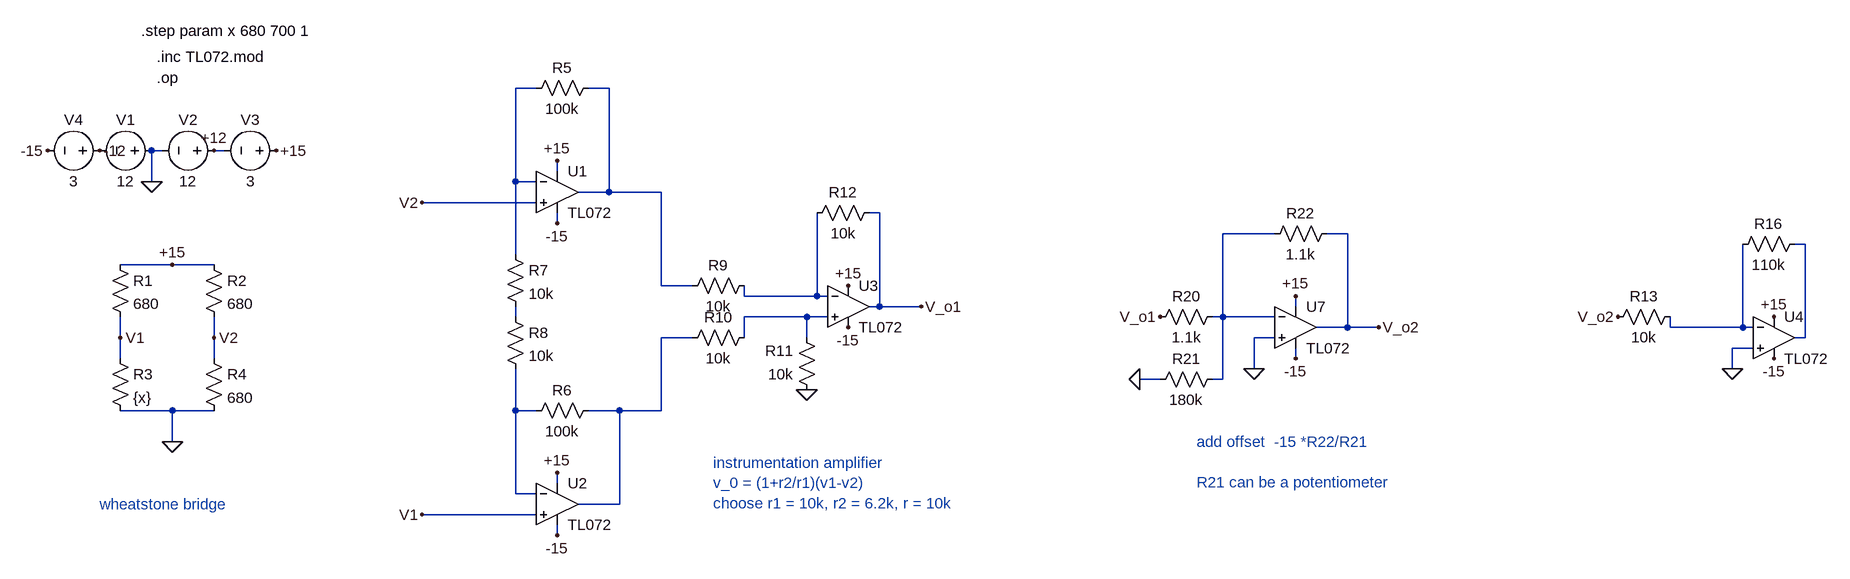
[diagram p0: schematic Draft1.asc]
Draft1.asc, the LTspice schematic file:
Version 4
SHEET 1 3256 748
WIRE 1008 -240 976 -240
WIRE 1120 -240 1088 -240
WIRE 432 -144 416 -144
WIRE 528 -144 512 -144
WIRE 1040 -112 1040 -128
WIRE 416 -96 416 -144
WIRE 976 -96 976 -240
WIRE 1008 -96 976 -96
WIRE 1120 -80 1120 -240
WIRE 1120 -80 1072 -80
WIRE 1200 -80 1120 -80
WIRE 1008 -64 832 -64
WIRE 1536 -48 1520 -48
WIRE 1040 -32 1040 -48
WIRE 2144 -16 2064 -16
WIRE 2256 -16 2224 -16
WIRE 2960 0 2944 0
WIRE 976 16 976 -96
WIRE 448 32 368 32
WIRE 512 32 448 32
WIRE 1200 64 1200 -80
WIRE 1248 64 1200 64
WIRE 1328 80 1328 64
WIRE 1440 80 1440 -48
WIRE 1440 80 1328 80
WIRE 1456 80 1440 80
WIRE 1536 96 1536 -48
WIRE 1536 96 1520 96
WIRE 1600 96 1536 96
WIRE 2176 96 2176 80
WIRE 976 112 976 96
WIRE 1424 112 1328 112
WIRE 1456 112 1424 112
WIRE 2064 112 2064 -16
WIRE 2064 112 2048 112
WIRE 2144 112 2064 112
WIRE 2256 128 2256 -16
WIRE 2256 128 2208 128
WIRE 2304 128 2256 128
WIRE 2752 128 2752 112
WIRE 2864 128 2864 0
WIRE 2864 128 2752 128
WIRE 2880 128 2864 128
WIRE 368 144 368 112
WIRE 512 144 512 112
WIRE 1248 144 1200 144
WIRE 1328 144 1328 112
WIRE 1424 144 1424 112
WIRE 2144 144 2112 144
WIRE 2960 144 2960 0
WIRE 2960 144 2944 144
WIRE 2880 160 2848 160
WIRE 368 176 368 144
WIRE 512 176 512 144
WIRE 2176 176 2176 160
WIRE 2112 192 2112 144
WIRE 2848 192 2848 160
WIRE 1968 208 1936 208
WIRE 2064 208 2064 112
WIRE 2064 208 2048 208
WIRE 448 256 368 256
WIRE 512 256 448 256
WIRE 976 256 976 192
WIRE 1008 256 976 256
WIRE 1136 256 1088 256
WIRE 1200 256 1200 144
WIRE 1200 256 1136 256
WIRE 448 304 448 256
WIRE 1040 368 1040 352
WIRE 976 384 976 256
WIRE 1008 384 976 384
WIRE 1136 400 1136 256
WIRE 1136 400 1072 400
WIRE 1008 416 832 416
WIRE 1040 448 1040 432
FLAG 416 -96 0
FLAG 336 -144 -12
FLAG 512 -144 +12
FLAG 608 -144 +15
FLAG 448 32 +15
FLAG 1424 224 0
FLAG 256 -144 -15
FLAG 1488 64 +15
FLAG 1488 128 -15
FLAG 512 144 V2
FLAG 368 144 V1
FLAG 832 -64 V2
FLAG 832 416 V1
FLAG 1040 -128 +15
FLAG 1040 -32 -15
FLAG 1040 352 +15
FLAG 1040 448 -15
FLAG 2176 80 +15
FLAG 2112 192 0
FLAG 2176 176 -15
FLAG 448 304 0
FLAG 2304 128 V_o2
FLAG 2912 112 +15
FLAG 2912 176 -15
FLAG 2848 192 0
FLAG 1600 96 V_o1
FLAG 1968 112 V_o1
FLAG 2672 112 V_o2
FLAG 1936 208 0
SYMBOL voltage 432 -144 R90
WINDOW 0 -32 56 VBottom 2
WINDOW 3 32 56 VTop 2
SYMATTR InstName V1
SYMATTR Value 12
SYMBOL voltage 528 -144 R90
WINDOW 0 -32 56 VBottom 2
WINDOW 3 32 56 VTop 2
SYMATTR InstName V2
SYMATTR Value 12
SYMBOL voltage 624 -144 R90
WINDOW 0 -32 56 VBottom 2
WINDOW 3 32 56 VTop 2
SYMATTR InstName V3
SYMATTR Value 3
SYMBOL res 352 16 R0
SYMATTR InstName R1
SYMATTR Value 680
SYMBOL res 496 16 R0
SYMATTR InstName R2
SYMATTR Value 680
SYMBOL res 352 160 R0
SYMATTR InstName R3
SYMATTR Value {x}
SYMBOL res 496 160 R0
SYMATTR InstName R4
SYMATTR Value 680
SYMBOL res 1344 48 R90
WINDOW 0 0 56 VBottom 2
WINDOW 3 32 56 VTop 2
SYMATTR InstName R9
SYMATTR Value 10k
SYMBOL res 1344 128 R90
WINDOW 0 0 56 VBottom 2
WINDOW 3 32 56 VTop 2
SYMATTR InstName R10
SYMATTR Value 10k
SYMBOL res 1440 240 R180
WINDOW 0 36 76 Left 2
WINDOW 3 36 40 Left 2
SYMATTR InstName R11
SYMATTR Value 10k
SYMBOL res 1424 -32 R270
WINDOW 0 32 56 VTop 2
WINDOW 3 0 56 VBottom 2
SYMATTR InstName R12
SYMATTR Value 10k
SYMBOL Opamps\\opamp2 1488 32 R0
SYMATTR InstName U3
SYMATTR Value TL072
SYMBOL voltage 352 -144 R90
WINDOW 0 -32 56 VBottom 2
WINDOW 3 32 56 VTop 2
SYMATTR InstName V4
SYMATTR Value 3
SYMBOL OpAmps\\opamp2 1040 -144 R0
SYMATTR InstName U1
SYMATTR Value TL072
SYMBOL OpAmps\\opamp2 1040 336 R0
SYMATTR InstName U2
SYMATTR Value TL072
SYMBOL res 1104 -256 R90
WINDOW 0 0 56 VBottom 2
WINDOW 3 32 56 VTop 2
SYMATTR InstName R5
SYMATTR Value 100k
SYMBOL res 1104 240 R90
WINDOW 0 0 56 VBottom 2
WINDOW 3 32 56 VTop 2
SYMATTR InstName R6
SYMATTR Value 100k
SYMBOL res 960 0 R0
SYMATTR InstName R7
SYMATTR Value 10k
SYMBOL res 960 96 R0
SYMATTR InstName R8
SYMATTR Value 10k
SYMBOL OpAmps\\opamp2 2176 64 R0
SYMATTR InstName U7
SYMATTR Value TL072
SYMBOL res 2064 96 R90
WINDOW 0 0 56 VBottom 2
WINDOW 3 32 56 VTop 2
SYMATTR InstName R20
SYMATTR Value 1.1k
SYMBOL res 2064 192 R90
WINDOW 0 0 56 VBottom 2
WINDOW 3 32 56 VTop 2
SYMATTR InstName R21
SYMATTR Value 180k
SYMBOL res 2240 -32 R90
WINDOW 0 0 56 VBottom 2
WINDOW 3 32 56 VTop 2
SYMATTR InstName R22
SYMATTR Value 1.1k
SYMBOL res 2768 96 R90
WINDOW 0 0 56 VBottom 2
WINDOW 3 32 56 VTop 2
SYMATTR InstName R13
SYMATTR Value 10k
SYMBOL res 2848 16 R270
WINDOW 0 32 56 VTop 2
WINDOW 3 0 56 VBottom 2
SYMATTR InstName R16
SYMATTR Value 110k
SYMBOL Opamps\\opamp2 2912 80 R0
SYMATTR InstName U4
SYMATTR Value TL072
TEXT 424 -256 Left 2 !.op
TEXT 424 -288 Left 2 !.inc TL072.mod
TEXT 2024 304 Left 2 ;add offset  -15 *R22/R21\n \nR21 can be a potentiometer
TEXT 1280 336 Left 2 ;instrumentation amplifier\nv_0 = (1+r2/r1)(v1-v2)\nchoose r1 = 10k, r2 = 6.2k, r = 10k
TEXT 336 400 Left 2 ;wheatstone bridge
TEXT 400 -328 Left 2 !.step param x 680 700 1

The netlist it stands for:
* Draft1.asc
V1 0 -12 12
V2 +12 0 12
V3 +15 +12 3
R1 +15 V1 680
R2 +15 V2 680
R3 V1 0 {x}
R4 V2 0 680
R9 N005 N002 10k
R10 N007 N009 10k
R11 0 N007 10k
R12 N005 V_o1 10k
XU3 N007 N005 +15 -15 V_o1 TL072  ; pins In+ In- V+ V- OUT
V4 -12 -15 3
XU1 V2 N001 +15 -15 N002 TL072  ; pins In+ In- V+ V- OUT
XU2 V1 N010 +15 -15 N009 TL072  ; pins In+ In- V+ V- OUT
R5 N002 N001 100k
R6 N009 N010 100k
R7 N001 N006 10k
R8 N006 N010 10k
XU7 0 N003 +15 -15 V_o2 TL072  ; pins In+ In- V+ V- OUT
R20 N003 V_o1 1.1k
R21 N003 0 180k
R22 V_o2 N003 1.1k
R13 N008 V_o2 10k
R16 N008 N004 110k
XU4 0 N008 +15 -15 N004 TL072  ; pins In+ In- V+ V- OUT
.op
.inc TL072.mod
* add offset  -15 *R22/R21
* R21 can be a potentiometer
* instrumentation amplifier
* v_0 = (1+r2/r1)(v1-v2)
* choose r1 = 10k, r2 = 6.2k, r = 10k
* wheatstone bridge
.step param x 680 700 1
.backanno
.end

* Results of the author's LTspice run, read from the files saved beside the schematic
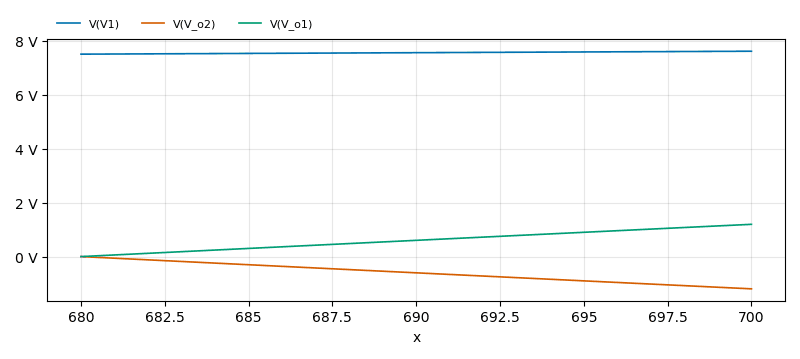
[diagram p1: Operating Point of Draft1.asc, plotted from the saved traces]
* Operating Point, 1 run:
*   V(V1): 7.5 V at x=680 , 7.609 V at x=700 , min 7.5 V, max 7.609 V
*   V(V_o2): 207 µV at x=680 , -1.195 V at x=700 , min -1.195 V, max 207 µV
*   V(V_o1): -184.9 µV at x=680 , 1.195 V at x=700 , min -184.9 µV, max 1.195 V
* From the log:
*   Semiconductor Device Operating Points:
*                           --- Diodes ---
*   Name:    d:u4:p      d:u4:ln     d:u4:lp     d:u4:e      d:u4:c
*   Model:    u4:dx       u4:dx       u4:dx       u4:dx       u4:dx
*   Id:     -3.00e-11   -2.50e-11   -2.50e-11   -1.28e-11   -1.28e-11
*   Vd:     -3.00e+01   -2.50e+01   -2.50e+01   -1.28e+01   -1.28e+01
*   Req:     1.00e+12    1.00e+12    1.00e+12    1.00e+12    1.00e+12
*   CAP:     0.00e+00    0.00e+00    0.00e+00    0.00e+00    0.00e+00
*   Name:    d:u7:p      d:u7:ln     d:u7:lp     d:u7:e      d:u7:c
*   Model:    u7:dx       u7:dx       u7:dx       u7:dx       u7:dx
*   Id:     -3.00e-11   -2.50e-11   -2.50e-11   -1.28e-11   -1.28e-11
*   Vd:     -3.00e+01   -2.50e+01   -2.50e+01   -1.28e+01   -1.28e+01
*   Req:     1.00e+12    1.00e+12    1.00e+12    1.00e+12    1.00e+12
*   CAP:     0.00e+00    0.00e+00    0.00e+00    0.00e+00    0.00e+00
*   Name:    d:u2:p      d:u2:ln     d:u2:lp     d:u2:e      d:u2:c
*   Model:    u2:dx       u2:dx       u2:dx       u2:dx       u2:dx
*   Id:     -3.00e-11   -2.54e-11   -2.46e-11   -2.03e-11   -5.30e-12
*   Vd:     -3.00e+01   -2.54e+01   -2.46e+01   -2.03e+01   -5.30e+00
*   Req:     1.00e+12    1.00e+12    1.00e+12    1.00e+12    1.00e+12
*   CAP:     0.00e+00    0.00e+00    0.00e+00    0.00e+00    0.00e+00
*   Name:    d:u1:p      d:u1:ln     d:u1:lp     d:u1:e      d:u1:c
*   Model:    u1:dx       u1:dx       u1:dx       u1:dx       u1:dx
*   Id:     -3.00e-11   -2.54e-11   -2.46e-11   -2.03e-11   -5.30e-12
*   Vd:     -3.00e+01   -2.54e+01   -2.46e+01   -2.03e+01   -5.30e+00
*   Req:     1.00e+12    1.00e+12    1.00e+12    1.00e+12    1.00e+12
*   CAP:     0.00e+00    0.00e+00    0.00e+00    0.00e+00    0.00e+00
*   Name:    d:u3:p      d:u3:ln     d:u3:lp     d:u3:e      d:u3:c
*   Model:    u3:dx       u3:dx       u3:dx       u3:dx       u3:dx
*   Id:     -3.00e-11   -2.46e-11   -2.54e-11   -1.28e-11   -1.28e-11
*   Vd:     -3.00e+01   -2.46e+01   -2.54e+01   -1.28e+01   -1.28e+01
*   Req:     1.00e+12    1.00e+12    1.00e+12    1.00e+12    1.00e+12
*   CAP:     0.00e+00    0.00e+00    0.00e+00    0.00e+00    0.00e+00
*                           --- JFET Transistors ---
*   Name:    j:u4:2      j:u4:1      j:u7:2      j:u7:1      j:u2:2
*   Model:    u4:jx       u4:jx       u7:jx       u7:jx       u2:jx
*   Id:     -9.77e-05   -9.77e-05   -9.77e-05   -9.77e-05   -9.40e-05
*   Vgs:     3.99e-01    3.99e-01    3.99e-01    3.99e-01    4.10e-01
*   Vds:    -1.43e+01   -1.43e+01   -1.43e+01   -1.43e+01   -2.18e+01
*   Gm:      3.25e-04    3.25e-04    3.25e-04    3.25e-04    3.19e-04
*   Gds:     0.00e+00    0.00e+00    0.00e+00    0.00e+00    0.00e+00
*   Cgs:     0.00e+00    0.00e+00    0.00e+00    0.00e+00    0.00e+00
*   Cgd:     0.00e+00    0.00e+00    0.00e+00    0.00e+00    0.00e+00
*   Name:    j:u2:1      j:u1:2      j:u1:1      j:u3:2      j:u3:1
*   Model:    u2:jx       u1:jx       u1:jx       u3:jx       u3:jx
*   Id:     -9.41e-05   -9.40e-05   -9.41e-05   -9.59e-05   -9.59e-05
*   Vgs:     4.10e-01    4.10e-01    4.10e-01    4.04e-01    4.04e-01
*   Vds:    -2.18e+01   -2.18e+01   -2.18e+01   -1.80e+01   -1.80e+01
*   Gm:      3.19e-04    3.19e-04    3.19e-04    3.22e-04    3.22e-04
*   Gds:     0.00e+00    0.00e+00    0.00e+00    0.00e+00    0.00e+00
*   Cgs:     0.00e+00    0.00e+00    0.00e+00    0.00e+00    0.00e+00
*   Cgd:     0.00e+00    0.00e+00    0.00e+00    0.00e+00    0.00e+00